# Altium schematic sheet fuelPumpSchematic.SchDoc
size A4; SheetNumber: 1; SheetTotal: 1
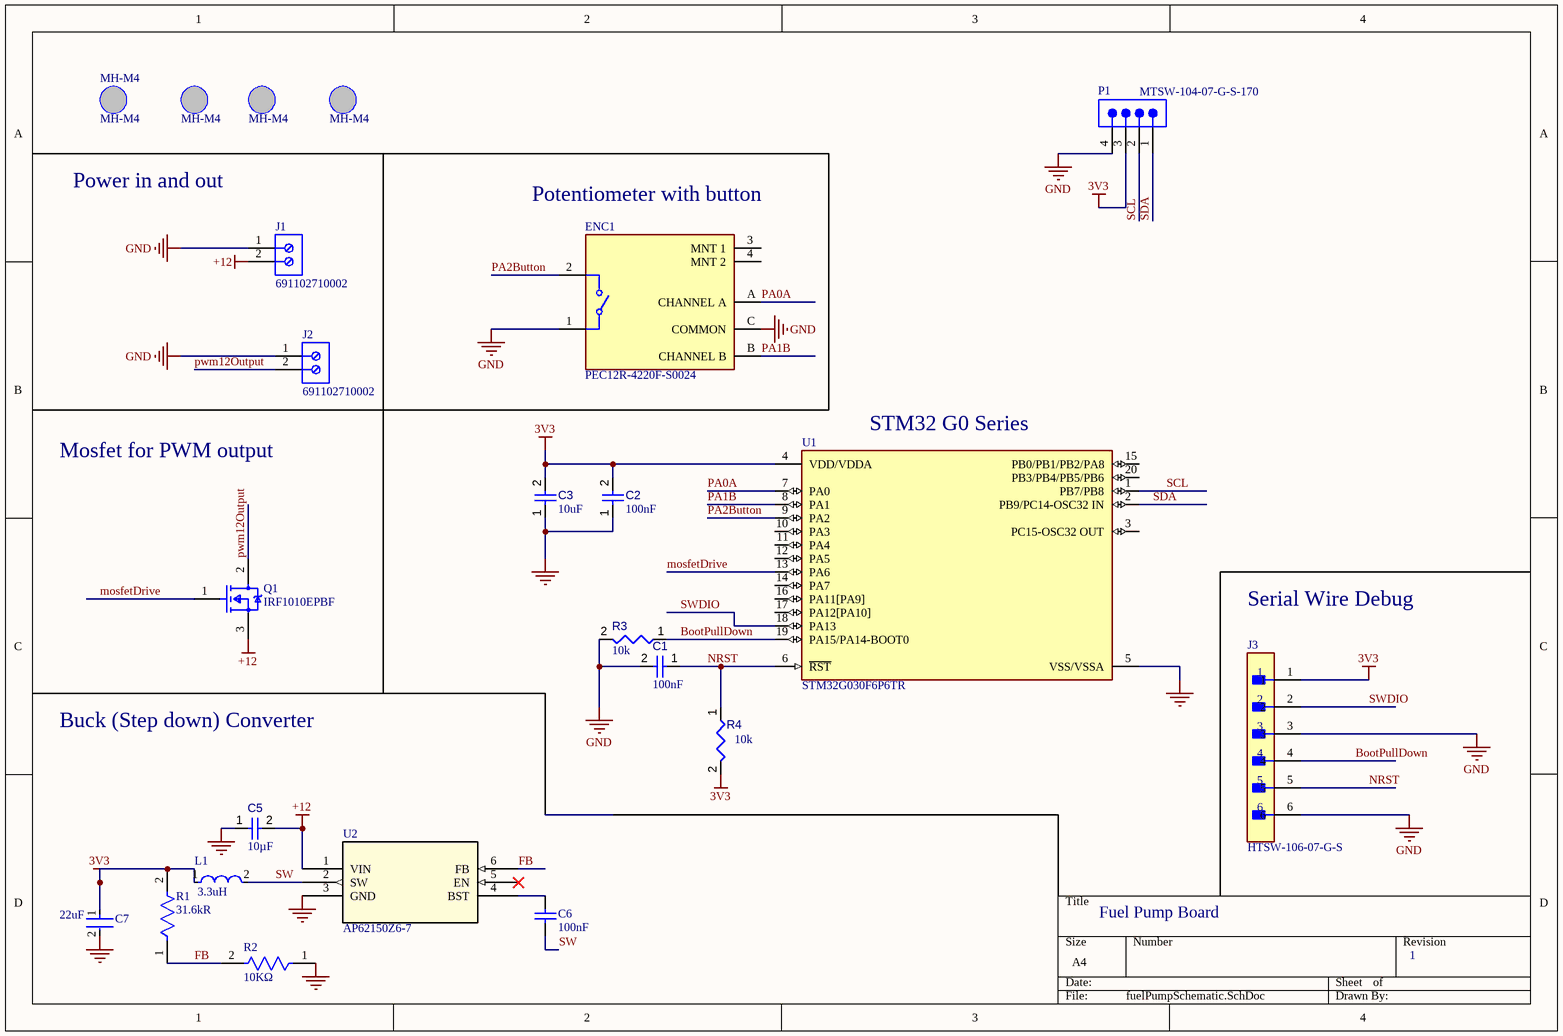
[diagram p0: fuelPumpSchematic.SchDoc]

## Parts
C1  value 100nF  [CAPC2013X95X50LL10T25]  (hidden comment: Capacitor 100 nF +/-10% 50 V 0805)
C2  value 100nF  [CAPC2013X95X50LL10T25]  (hidden comment: Capacitor 100 nF +/-10% 50 V 0805)
C3  value 10uF  [CAPC2013X95X50LL10T25]  (hidden comment: Capacitor 100 nF +/-10% 50 V 0805)
C5  value 10µF  [CAPC0603(1608)100_L]  (hidden comment: Capacitor 10µF +/-20% 10V 0603)
C6  Capacitance: 100nF  [CAPC1608X92X38NL15T08]  (hidden comment: VJ0603Y104KXXAP)
C7  Capacitance: 22uF  [FP-GRM186-0_2-IPC_B]  (hidden comment: GRM186R60J226ME15D)
ENC1  PEC12R-4220F-S0024  [FP-PEC12R-4220F-S0024-MFG]
J1  691102710002  [691102710002]
J2  691102710002  [691102710002]
J3  HTSW-106-07-G-S  [FP-HTSW-106-07-G-S-MFG]
L1  3.3uH  [FP-DFE322520F_D-MFG]
MH-M4  MH-M4  [MH-M4]
MH-M5  MH-M4  [MH-M4]
MH-M6  MH-M4  [MH-M4]
MH-M7  MH-M4  [MH-M4]
P1  MTSW-104-07-G-S-170  [SMTC-MTSW-104-07-X-S-170]
Q1  IRF1010EPBF  [FP-PG-TO220-3-MFG]
R1  Resistance: 31.6kR  [FP-AC0603-MFG]  (hidden comment: AC0603FR-0731K6L)
R2  Resistance: 10KΩ  [FP-RT0603-MFG]  (hidden comment: RT0603BRC0710KL)
R3  value 10k  [RESC2013X50X35ML15T15]  (hidden comment: Resistor 10k +/-1% 0805 125 mW)
R4  value 10k  [RESC2013X50X35ML15T15]  (hidden comment: Resistor 10k +/-1% 0805 125 mW)
U1  STM32G030F6P6TR  [FP-TSSOP20-YA-IPC_A]
U2  AP62150Z6-7  [SOT563_DIO]

## Nets
3V3: C2.2 C3.2 C7.1 J3.1 L1.1 P1.3 R1.2 R4.2 U1.4(VDD/VDDA)
+12: C5.2 J1.2 Q1.3(S) U2.1(VIN)
GND: C1.2 C2.1 C3.1 C5.1 C7.2 ENC1.1 ENC1.C(COMMON) J1.1 J2.1 J3.3 J3.6 P1.4 R2.1 R3.2 U1.5(VSS/VSSA) U2.3(GND)
BootPullDown: J3.4 R3.1 U1.19(PA15/PA14-BOOT0)
FB: R1.1 R2.2 U2.6(FB)
mosfetDrive: Q1.1(G) U1.13(PA6)
NRST: C1.1 J3.5 R4.1 U1.6(~{RST})
PA0A: ENC1.A(CHANNEL_A) U1.7(PA0)
PA1B: ENC1.B(CHANNEL_B) U1.8(PA1)
PA2Button: ENC1.2 U1.9(PA2)
pwm12Output: J2.2 Q1.2(D)
SCL: P1.2 U1.1(PB7/PB8)
SDA: P1.1 U1.2(PB9/PC14-OSC32_IN)
SW: C6.1 L1.2 U2.2(SW)
SWDIO: J3.2 U1.18(PA13)
NetC6_2: C6.2 U2.4(BST)

Not connected (* = marked no-connect by the designer): ENC1 3(MNT_1) 4(MNT_2); U1 3(PC15-OSC32_OUT) 10(PA3) 11(PA4) 12(PA5) 14(PA7) 15(PB0/PB1/PB2/PA8) 16(PA11[PA9]) 17(PA12[PA10]) 20(PB3/PB4/PB5/PB6); U2 5(EN)*

## Notes on the sheet
- Power in and out
- (near ENC1) Potentiometer with button
- (near U1) STM32 G0 Series
- Mosfet for PWM output
- Serial Wire Debug
- Buck (Step down) Converter
- Fuel Pump Board
- 1

## Library data of the parts
C1-C3 = CMP-001-00018-6: Chip Capacitor, 100 nF, +/- 10%, 50 V, 0805 (2012 Metric); Capacitor Type: Ceramic; Voltage Rating: 50V; Pins: 2; Max Operating Temperature: 125°C; Min Operating Temperature: -55°C; Mounting Technology: SM; Case/Package: 0805; RoHS Compliant: True; Tolerance: 10%
C5 = CMP-001-00075-4: Chip Capacitor, 10µF +/-20%, 10V, 0603, Thickness 1 mm; Tolerance: 10%; Voltage Rating: 10V; Max Operating Temperature: 85°C; Pins: 2; Case/Package: 0603; Mounting Technology: SMT; Min Operating Temperature: -55°C
C6 = CMP-2006-01166-1: Manufacturer: Vitramon; Part Number: VJ0603Y104KXXAP
C7 = CMP-06035-038491-1: Chip Multilayer Ceramic Capacitors for General Purpose, 0603, 22uF, X5R, 15%, 20%, 6.3V; Mount: Surface Mount; Thickness: 0.028inch; Tolerance: 20%; Width: 0.031inch; Voltage Rating (DC): 6.3V; Min Operating Temperature: -55°C; Voltage Rating: 6.3V; Dielectric: X5R; Case Code (Imperial): 0603; Length: 0.063inch; Case/Package: 0603; Packaging: Tape and Reel; Case Code (Metric): 1608; Max Operating Temperature: 85°C
ENC1 = CMP-07421-000021-1: ROTARY ENCODER MECHANICAL 24PPR; Built in Switch: Yes; Pulses per Revolution: 24; Output Type: Quadrature; Hole Diameter: 2mm; Number of Channels: 2; Max Supply Voltage (DC): 5V; RoHS Compliant: Yes; Max Operating Temperature: 70°C; Length: 26mm; Width: 12.5mm; Encoder Type: Mechanical; Series: PEC12R; Mount: Through Hole; Height: 13.4mm; Packaging: Bulk; Package Quantity: 150; Termination: PC Pin; Min Operating Temperature: -30°C; REACH SVHC: No SVHC; Detent: Yes; Orientation: Vertical
J1 J2 = CMP-1502-03258-3: 102 Series 5MM Pitch Straight, Pcb Terminal Block, Through Hole, 2 Way; Current Rating: 15A; Wire/Cable Gauge: 22AWG; Voltage: 300V; Number of Positions Per Level: 2; Plating: Steel; Stripping Length: -6mm; Wire Gauge (Min): 14AWG; Number of Levels: 1; Pitch: 5.0038mm; Width: 11.2mm; Max Operating Temperature: 105°C; Contact Material: Brass; Contact Plating: Tin; Current: 15A; Wire Gauge (Max): 22AWG; Mount: Through Hole; Length: 7.5mm; Min Operating Temperature: -40°C; RoHS: Compliant; Color: Blue; Number of Pins: 2; Housing Material: Nylon; Termination: Screw; Height: 13.4mm; Number of Contacts: 2; Lead Pitch: 5mm; Voltage Rating: 300V; Packaging: Box
J3 = CMP-02766-001515-1: CONN HEADER VERT 6POS 2.54MM; Number of Positions: 6; Pitch: 0.1inch; Max Voltage Rating (AC): 550V; Gender: Male; Max Current Rating: 7.6A; Contact Type: Male Pin; Contact Finish - Mating: GOLD; REACH SVHC: No SVHC; Number of Rows: 1; Insulation Material: Polymer; Housing Color: Natural; Connector Type: Header; Termination: Solder; Flammability Rating: UL94 V-0; Mount: Through Hole; Contact Shape: Square; Fastening Type: Pull; Max Operating Temperature: 125°C; Contact Material: Bronze; RoHS Compliant: Yes; Series: HTSW; Min Operating Temperature: -55°C; Contact Mating Length: 0.23inch; Orientation: Straight; Number of Contacts: 6; Depth: 2.48mm; Housing Material: Polymer; Insulation Color: Natural; Lead Free: Lead Free; Radiation Hardening: No; Length: 15.24mm; Contact Plating: Gold; Color: Natural; Packaging: Rail/Tube
L1 = CMP-06042-016325-1: FIXED IND 3.3UH 4200MA INFOTNMNT
MH-M4-MH-M7 = CMP-012-000000-1: 4.1mm not plated hole; Source: SamiSchLib.SchLib; Design Item ID: MH-M4
P1 = CMP-1024-00104-1: Modified .025" SQ Post Header, Through-hole, Vertical, -55 to 125 degC, 2.54 mm Pitch, 4-Pin, Male, RoHS; Manufacturer: Samtec; Pitch: 2.54 mm; Temperature Range: -55 to 125 degC; ComponentLink1URL: http://www.samtec.com; ComponentLink1Description: Manufacturer URL; ComponentLink3URL: http://www.samtec.com/documents/webfiles/cpdf/MTSW-XXX-XX-X-X-XXXX-XX-XXX-MKT1.pdf; DatasheetVersion: F-214; Orientation: Vertical; ComponentLink3Description: Package Specification; PackageReference: MTSW-104-07-X-S-170; PackageDescription: Assembly .025" [.64] SQ Post Terminal Strip; ComponentLink2Description: Datasheet; PackageVersion: BI, 2/1987; ComponentLink2URL: http://www.samtec.com/documents/webfiles/pdf/MTSW.PDF; PartNumber: MTSW-104-07-G-S-170; Mounting Technology: Through-hole; RoHS: True
Q1 = CMP-32901-000559-1: MOSFET N-CH 60V 84A TO-220AB; Element Configuration: Single; Turn-On Delay Time: 12ns; Gate to Source Voltage (Vgs): 20V; Rise Time: 78ns; Max Power Dissipation: 200W; Threshold Voltage: 4V; Rds On Max: 12mR; Turn-Off Delay Time: 48ns; Input Capacitance: 3.21nF; Packaging: Rail/Tube; Drain to Source Breakdown Voltage: 60V; RoHS Compliant: Yes; Min Operating Temperature: -55°C; Length: 0.42inch; Max Operating Temperature: 175°C; Continuous Drain Current (ID): 84A; Mount: Through Hole; Contact Plating: Tin; REACH SVHC: No SVHC; Power Dissipation: 200W; Height: 0.65inch; Drain to Source Voltage (Vdss): 60V; Drain to Source Resistance: 12mR; Case/Package: TO-220; Lead Free: Lead Free; Halogen Free: Not Halogen Free; Number of Pins: 3; Max Dual Supply Voltage: 60V; Width: 0.19inch
R1 = CMP-03412-010593-2: RES 31.6KΩ 1.00% 0.1W 0603; Power Rating: 100mW; Tolerance: 1%; Temperature Coefficient: 100ppm/°C; Voltage Rating: 50V; Packaging: Tape and Reel; Termination: SMD/SMT; Max Operating Temperature: 155°C; Weight: 7.1E-05oz; Length: 0.063inch; Case Code (Imperial): 0603; Case/Package: 0603; Width: 0.8mm; Case Code (Metric): 1608; Resistor Type: Thick Film; Min Operating Temperature: -55°C; Features: Moisture Resistant; Max Power Dissipation: 100mW; Height: 0.022inch; Number of Terminations: 2; Series: AC; RoHS Compliant: Yes
R2 = CMP-03412-009989-1: RES SMD 10K OHM 0.1% 1/10W 0603; Manufacturer: Yageo; Tolerance: 0.001; Value: 10KΩ; Power Rating: 0.1W; Voltage Rating: 75V; Temperature Coefficient: 15 ppm/°C; Device Class L2: Resistors; Temperature: -55°C to +155°C; Device Class L3: Chip SMD Resistors; Series: RT; RoHS: TRUE; Category: Res; Manufacturer Part Number: RT0603BRC0710KL; Composition: Thin Film; Temperature Range Low: -55°C; Temperature Range High: +155°C; Package: RT0603; Height: 0.55mm; Automotive: No; Device Class L1: Passive Components; Lead Free: Yes; Digikey Description: RES SMD 10K OHM 0.1% 1/10W 0603; Ipc Land Pattern Name: RESC16080X45; Octopart: https://octopart.com/rt0603brc0710kl-yageo-20648660; Footprint Url: http://www.yageo.com/exep/pages/download/literatures/PYu-R_Mount_10.pdf; ComponentLink2Description: Datasheet; ComponentLink2URL: http://www.yageo.com/documents/recent/PYu-RT_1-to-0.01_RoHS_L_9.pdf; Mouser Description: Res Thin Film 0603 10K Ohm 0.1% 1/10W ±15ppm/°C Molded SMD Paper T/R
R3 R4 = CMP-009-00018-5: Chip Resistor, 10 KOhm, +/- 1%, 125 mW, -55 to 155 degC, 0805 (2012 Metric); Power: 125mW; Voltage Rating: 150V; Tolerance: 1%; Pins: 2; Min Operating Temperature: -55°C; Case/Package: 0805; Max Operating Temperature: 155°C; RoHS Compliant: True; Mounting Technology: SM
U1 = CMP-12105-000113-1: IC MCU 32BIT 32KB FLASH 20TSSOP; RoHS Compliant: Yes
U2 = AP62150Z6-7: Description; Manufacturer_Name: Diodes Inc; Copyright: Copyright (C) 2025 Ultra Librarian. All rights reserved.; Manufacturer_Part_Number: AP62150Z6-7; RefDes: RefDes; Type: Type